# EAGLE design C-logo (EAGLE 9.5.2)
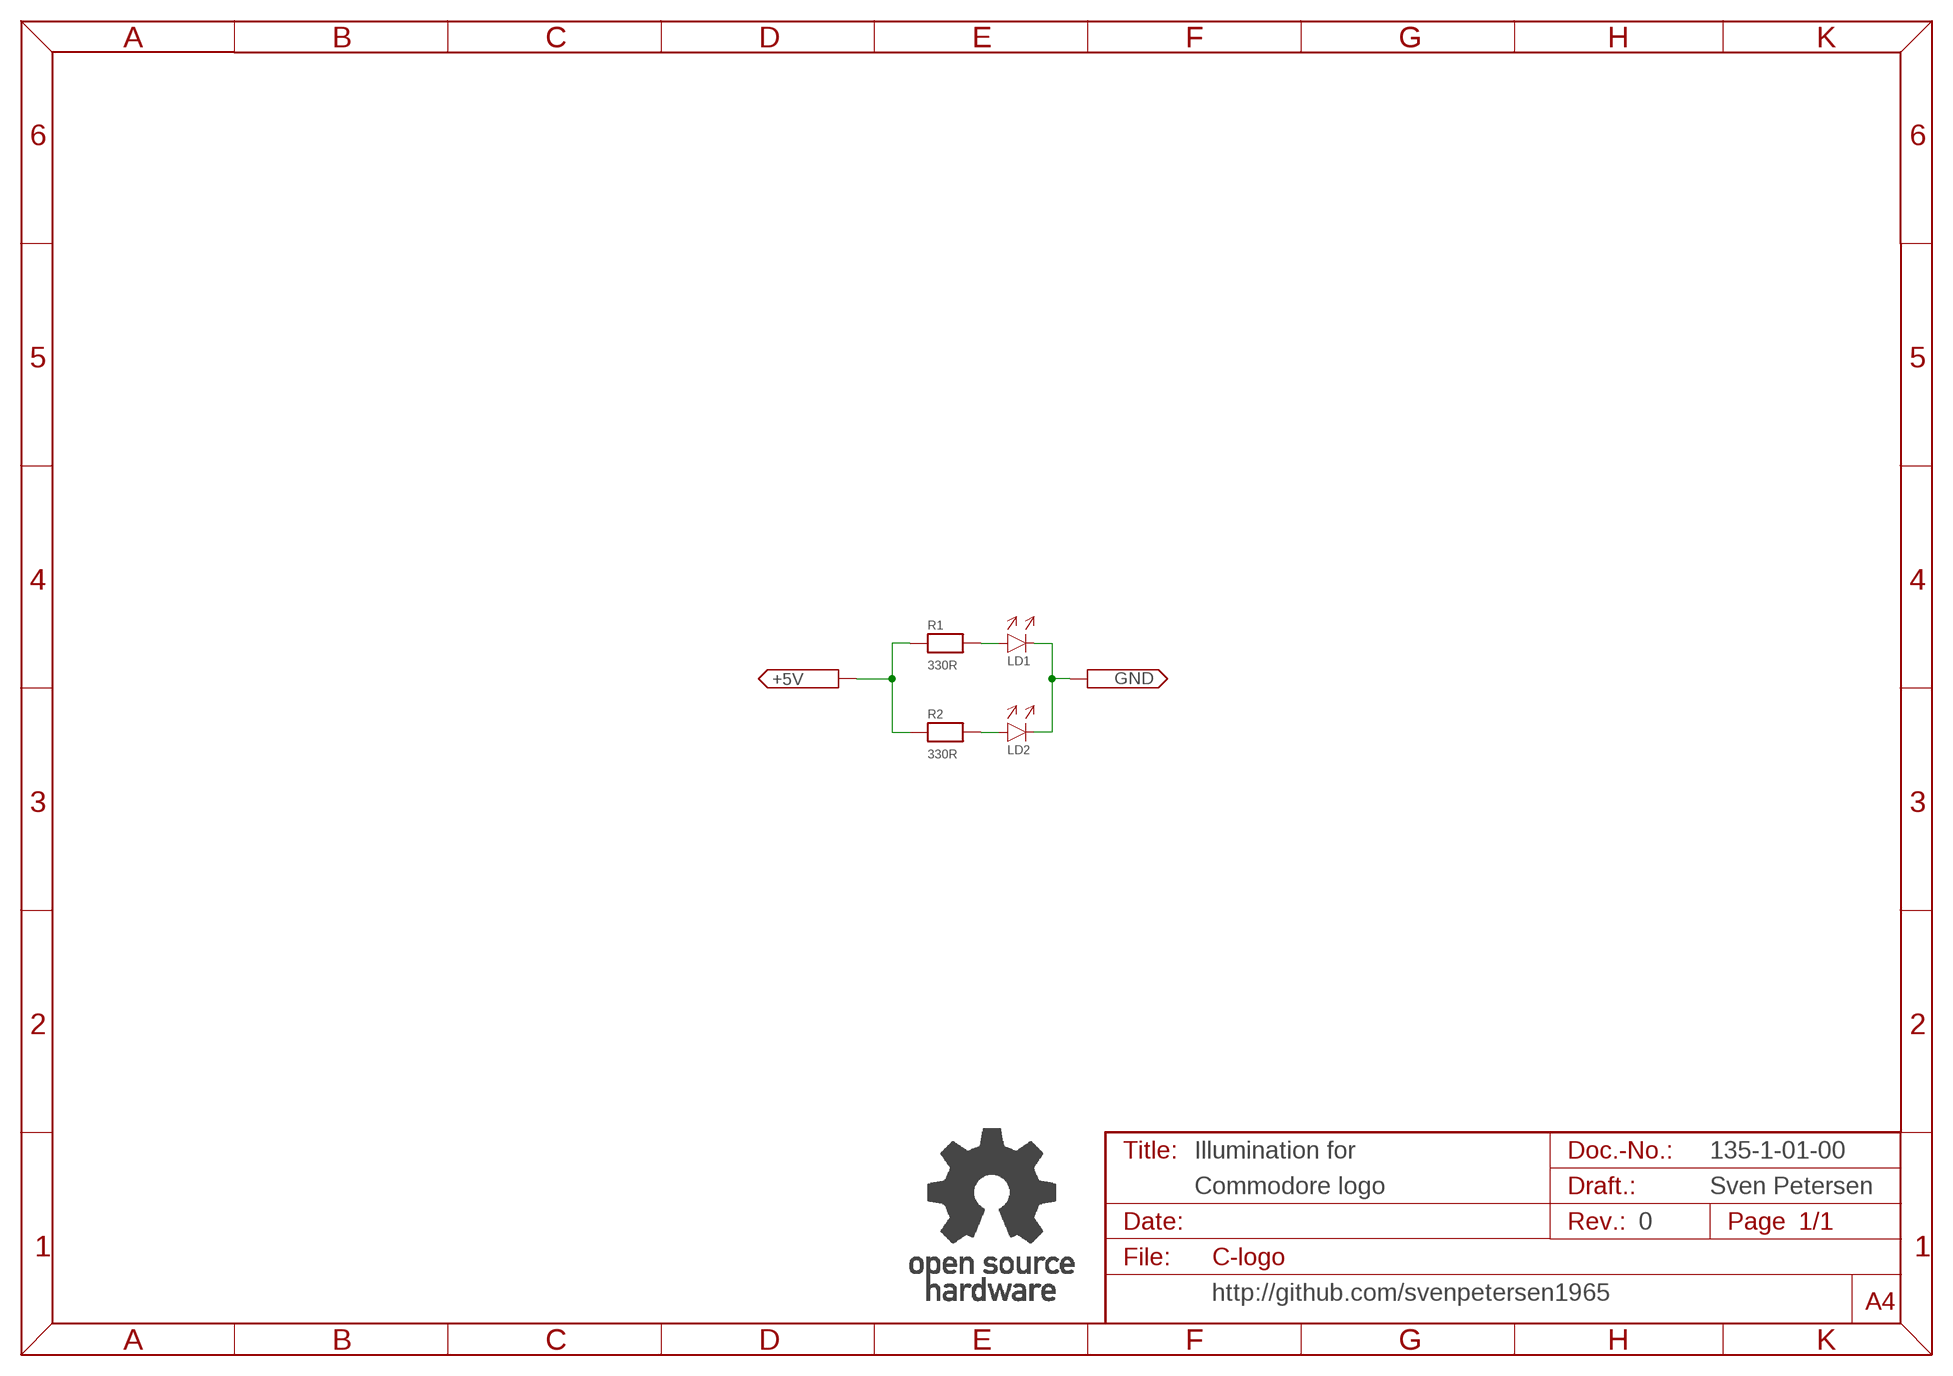
[diagram p0: schematic, sheet 1]

## Parts
+5V  PAD1,0/AUTO  [1.0/AUTO]
GND  PAD1,0/AUTO  [1.0/AUTO]
LD1  5MM90°INSERTED  [5MM_90°]
LD2  5MM90°INSERTED  [5MM_90°]
R1  330R  RES04  [R-10]
R2  330R  RES04  [R-10]
U$5  OPEN_SOURCE_HW  [OPENHW]

## Nets
GND: +5V.1 R1.1 R2.1
N$2: LD1.A R1.2
N$3: LD2.A R2.2
N$4: GND.1 LD1.K LD2.K

## Notes on the sheet
- Illumination for | 135-1-01-00
- Commodore logo | Sven Petersen
- 0
- http://github.com/svenpetersen1965

## Library data of the parts
+5V GND = Pads:PAD1,0/AUTO
LD1 LD2 = LED:5MM
R1 R2 = DISCRETE:RES04
U$5 = Logo:OPEN_SOURCE_HW

## Board
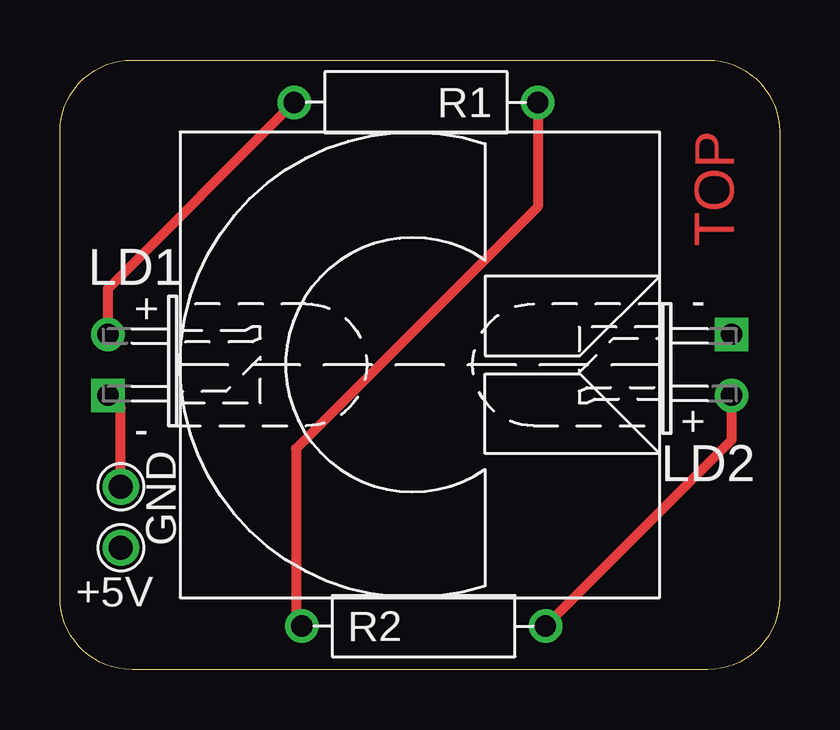
[diagram p1: board, top side]
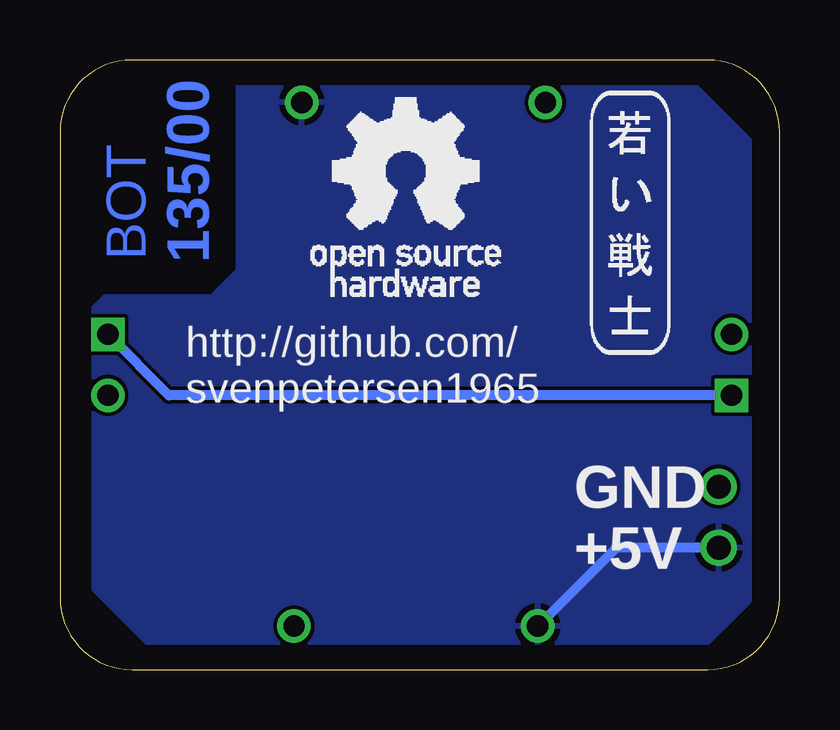
[diagram p2: board, bottom side, seen from below]

Size 30 x 25.4 mm. Coordinates in mm from the lower left corner, seen from the top.
Outline: 3,25.4 27,25.4 arc-90 30,22.4 30,3 arc-90 27,0 3,0 arc-90 0,3 0,22.4 arc-90 3,25.4
Copper layers (1*16): Top 0.035mm / dielectric 1.5mm / Bottom 0.035mm
Design rules "default": minimum track width 6mil, minimum drill 0.35mm, track to track 6mil, track to pad 6mil, pad to pad 6mil, via to via 6mil, smd to smd 6mil, copper to edge 40mil, drill to drill 6mil, minimum pad ring 10mil, minimum via ring 8mil, stop-mask expansion 4mil, vias tented up to drill 0mil, thermal gap 10mil

### Footprints (pad centres in the part's own frame; a part is rotated, then mirrored left to right if it is on the bottom)
1.0/AUTO = drill 1: 1 0,0
5MM_90° = drill 0.889 pad 1.397: A 0,1.27 | drill 0.889 pad 1.397 square: K 0,-1.27
R-10 = drill 0.889 pad 1.397: 1 -5.08,0; 2 5.08,0

### Placement (x,y rotation side)
+5V  2.54,5.08 180 top
GND  2.54,7.62 0 top
LD1  2,12.7 0 top
LD2  28,12.7 180 top
R1  14.84,23.64 180 top
R2  15.16,1.81 0 top
U$2  [2LAYER]  28.1,17.62 90 top
U$3  [SVEN_TAG]  6.19,18.73 0 bottom
U$4  [PCB-TITLE/]  0,32.07 0 top  (outside the outline)
U$5  19.53,15.56 0 bottom

### Tracks (layer width: path | path; a pad name or v marks a point on that pad's centre or on a via)
GND
  Top 0.254: 9.84,2.05 R2.1
  Top 0.406: R1.1 19.92,19.29 9.84,9.21 9.84,2.05
  Bottom 0.406: +5V.1 6.81,5.08 R2.1
  pour Bottom: 3.81,24.61 1.27,22.07 1.27,2.86 3.65,0.48 25.72,0.48 28.57,3.33 28.57,15.08 28.1,15.56 23.65,15.56 23.02,16.19 22.54,16.67 22.54,24.77 3.97,24.77
N$2
  Top 0.406: LD1.A 2,15.87 R1.2
N$3
  Top 0.406: R2.2 28,9.57 LD2.A
N$4
  Top 0.406: GND.1 2.54,10.89 LD1.K
  Bottom 0.406: LD1.K 25.46,11.43 LD2.K

### Text on the board
Bottom: 135/00
bPlace: http://github.com/ / svenpetersen1965 | GND | +5V
Document: 135-2-01-00 | Sven Petersen / 2019 | 35µm | 2 | 0